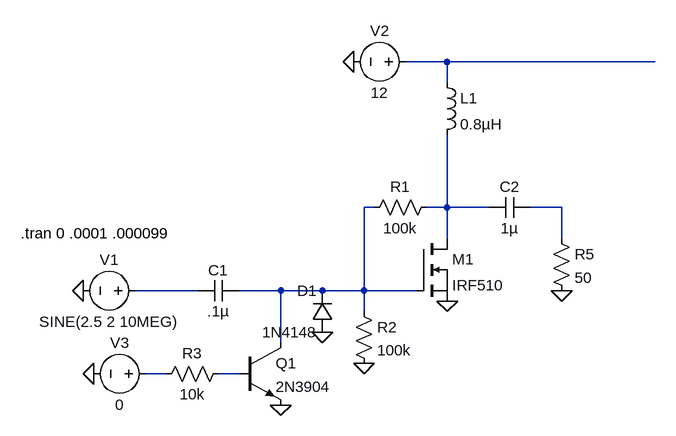
[diagram p0: schematic Draft1.asc]
Draft1.asc, the LTspice schematic file:
Version 4
SHEET 1 880 680
WIRE 240 -144 176 -144
WIRE 560 -144 240 -144
WIRE 240 -112 240 -144
WIRE 128 80 112 80
WIRE 240 80 240 -32
WIRE 240 80 208 80
WIRE 304 80 240 80
WIRE 416 80 368 80
WIRE 240 128 240 80
WIRE 416 128 416 80
WIRE -144 208 -240 208
WIRE -16 208 -80 208
WIRE 48 208 -16 208
WIRE 112 208 112 80
WIRE 112 208 48 208
WIRE 192 208 112 208
WIRE 112 240 112 208
WIRE -16 288 -16 208
WIRE -192 336 -224 336
WIRE -80 336 -112 336
FLAG -320 208 0
FLAG 112 320 0
FLAG 96 -144 0
FLAG 240 224 0
FLAG -304 336 0
FLAG -16 384 0
FLAG 416 208 0
FLAG 48 272 0
SYMBOL nmos 192 128 R0
SYMATTR InstName M1
SYMATTR Value IRF510
SYMBOL voltage -224 208 R90
WINDOW 0 -32 56 VBottom 2
WINDOW 3 32 56 VTop 2
WINDOW 123 0 0 Left 0
WINDOW 39 0 0 Left 0
SYMATTR InstName V1
SYMATTR Value SINE(2.5 2 10MEG)
SYMBOL res 96 224 R0
SYMATTR InstName R2
SYMATTR Value 100k
SYMBOL voltage 192 -144 R90
WINDOW 0 -32 56 VBottom 2
WINDOW 3 32 56 VTop 2
WINDOW 123 0 0 Left 0
WINDOW 39 0 0 Left 0
SYMATTR InstName V2
SYMATTR Value 12
SYMBOL res 224 64 R90
WINDOW 0 0 56 VBottom 2
WINDOW 3 32 56 VTop 2
SYMATTR InstName R1
SYMATTR Value 100k
SYMBOL cap -80 192 R90
WINDOW 0 0 32 VBottom 2
WINDOW 3 32 32 VTop 2
SYMATTR InstName C1
SYMATTR Value .1µ
SYMBOL npn -80 288 R0
SYMATTR InstName Q1
SYMATTR Value 2N3904
SYMBOL voltage -208 336 R90
WINDOW 0 -32 56 VBottom 2
WINDOW 3 32 56 VTop 2
WINDOW 123 0 0 Left 0
WINDOW 39 0 0 Left 0
SYMATTR InstName V3
SYMATTR Value 0
SYMBOL res -96 320 R90
WINDOW 0 0 56 VBottom 2
WINDOW 3 32 56 VTop 2
SYMATTR InstName R3
SYMATTR Value 10k
SYMBOL cap 368 64 R90
WINDOW 0 0 32 VBottom 2
WINDOW 3 32 32 VTop 2
SYMATTR InstName C2
SYMATTR Value 1µ
SYMBOL res 400 112 R0
SYMATTR InstName R5
SYMATTR Value 50
SYMBOL diode 64 272 R180
WINDOW 0 24 64 Left 2
WINDOW 3 24 0 Left 2
SYMATTR InstName D1
SYMATTR Value 1N4148
SYMBOL ind 224 -128 R0
SYMATTR InstName L1
SYMATTR Value 0.8µH
TEXT -416 120 Left 2 !.tran 0 .0001 .000099

The netlist it stands for:
* Draft1.asc
M1 N003 N002 0 0 IRF510
V1 N005 0 SINE(2.5 2 10MEG)
R2 N002 0 100k
V2 N001 0 12
R1 N003 N002 100k
C1 N002 N005 .1µ
Q1 N002 N007 0 0 2N3904
V3 N006 0 0
R3 N007 N006 10k
C2 N004 N003 1µ
R5 N004 0 50
D1 0 N002 1N4148
L1 N001 N003 0.8µH
.model D D
.lib standard.dio
.model NPN NPN
.model PNP PNP
.lib standard.bjt
.model NMOS NMOS
.model PMOS PMOS
.lib standard.mos
.tran 0 .0001 .000099
.backanno
.end